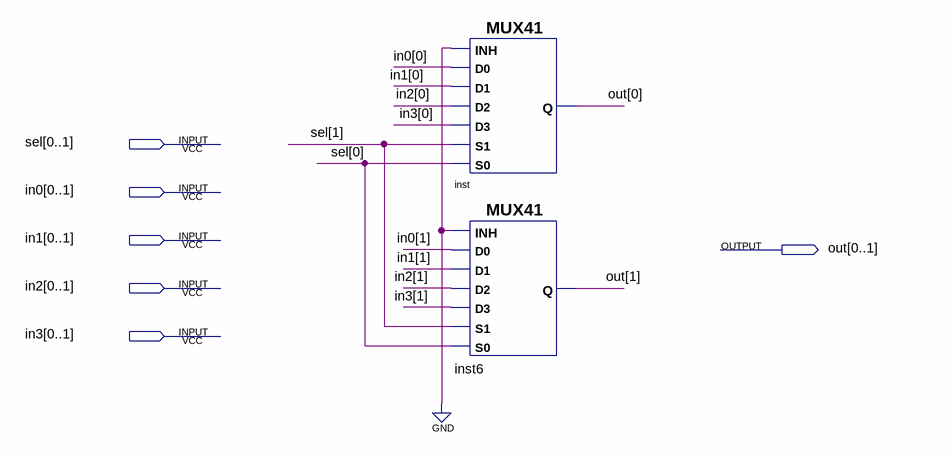
[diagram p0: schematic sheet]
// Quartus schematic 4x2Multiplexer.bdf as structural Verilog: 2 symbols, 6 pins
module \4x2Multiplexer  (
  input  [0:1] sel,
  input  [0:1] in0,
  input  [0:1] in1,
  input  [0:1] in2,
  input  [0:1] in3,
  output [0:1] out
);

  MUX41 inst (.S0(sel[0]), .D2(in2[0]), .S1(sel[1]), .D3(in3[0]), .D0(in0[0]), .INH(1'b0), .D1(in1[0]), .Q(out[0]));
  MUX41 inst6 (.S0(sel[0]), .D2(in2[1]), .S1(sel[1]), .D3(in3[1]), .D0(in0[1]), .INH(1'b0), .D1(in1[1]), .Q(out[1]));
endmodule
